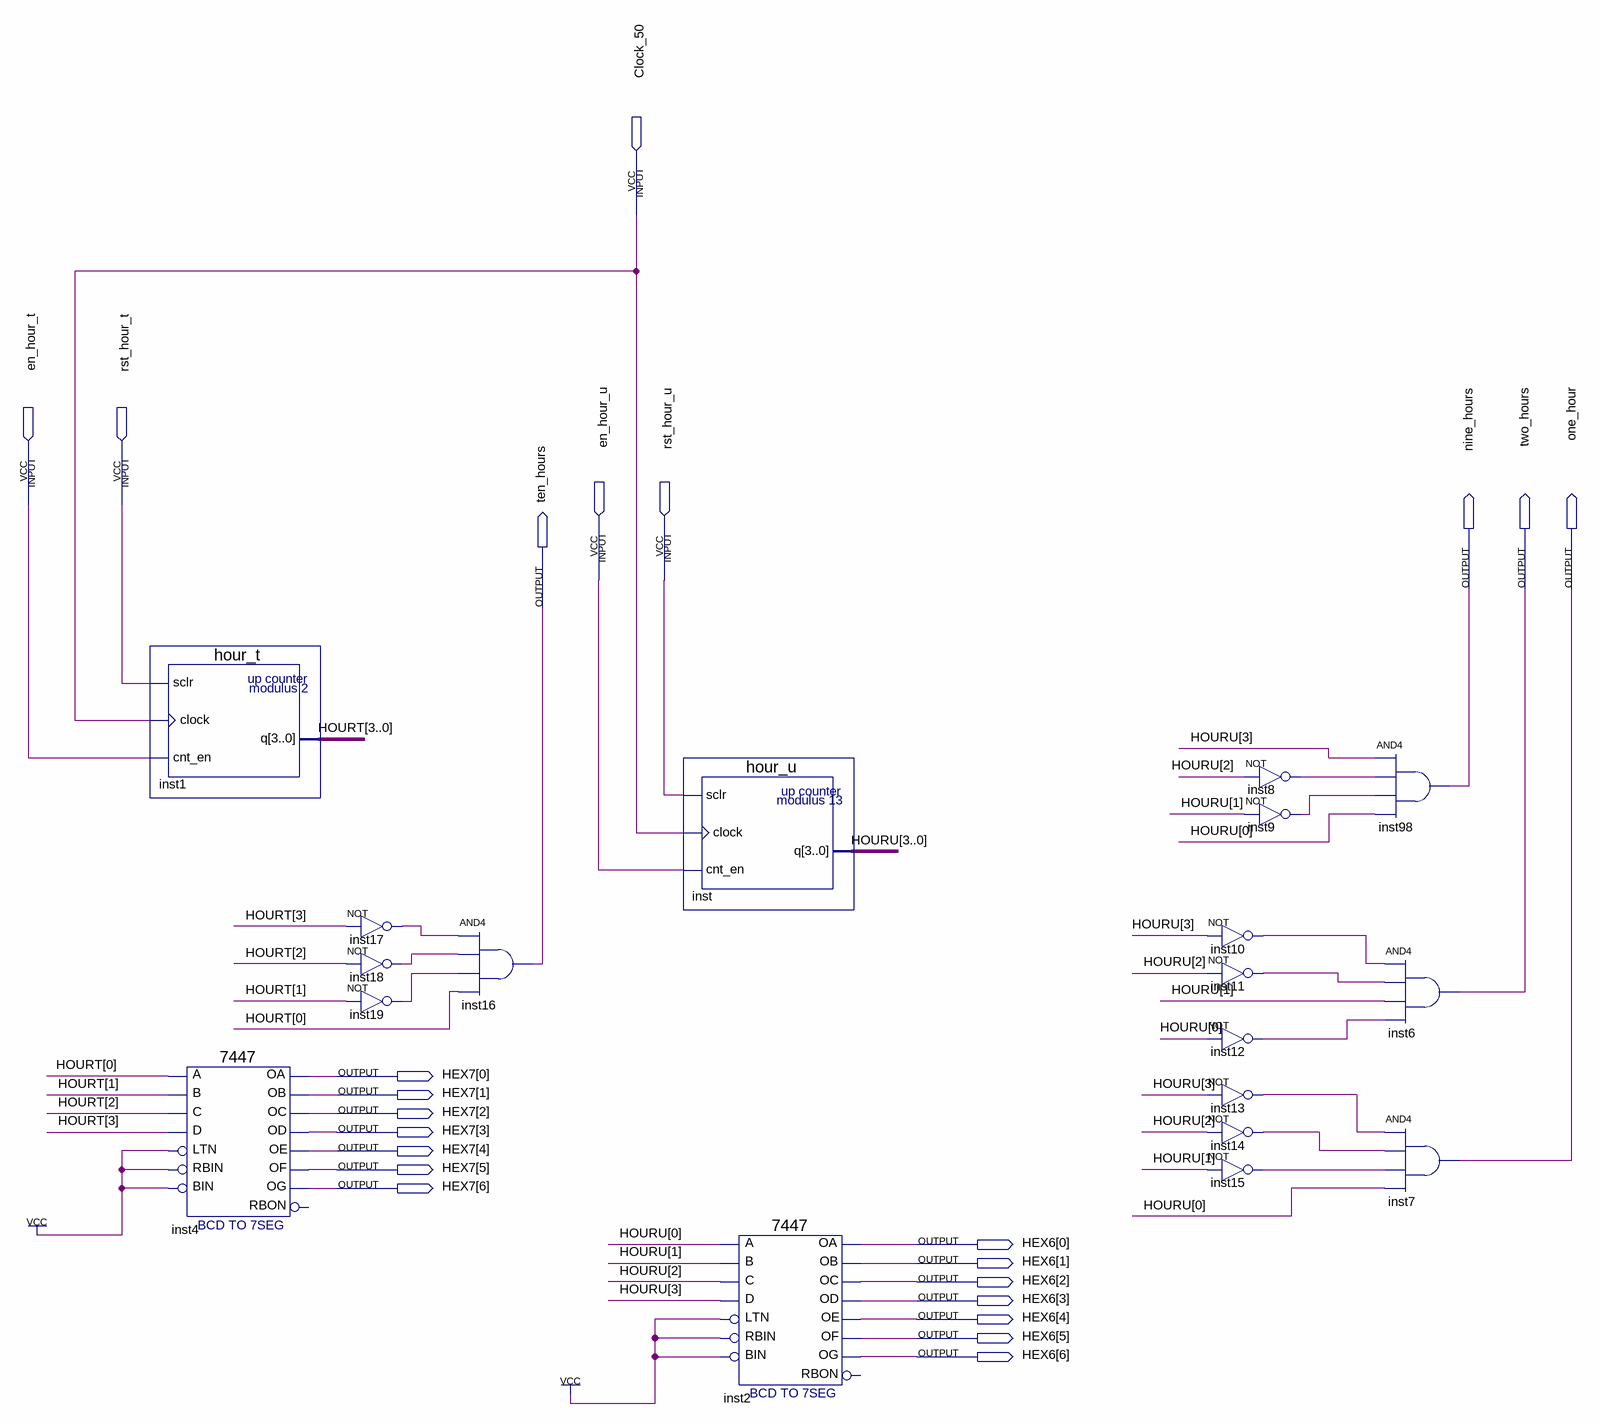
[diagram p0: schematic sheet]
// Quartus schematic Final.bdf as structural Verilog: 19 symbols, 23 pins
module Final (
  input  Clock_50,
  input  en_hour_t,
  input  rst_hour_t,
  input  en_hour_u,
  input  rst_hour_u,
  output nine_hours,
  output two_hours,
  output one_hour,
  output ten_hours,
  output [6:0] HEX7,
  output [6:0] HEX6
);

  wire inst8_out, inst9_out, inst10_out, inst11_out, inst12_out, inst13_out, inst14_out, inst15_out,
       inst17_out, inst18_out, inst19_out;
  wire [3:0] HOURT, HOURU;

  hour_t inst1 (.sclr(rst_hour_t), .clock(Clock_50), .cnt_en(en_hour_t), .q(HOURT));
  \7447  inst4 (
    .LTN(1'b1), .B(HOURT[1]), .C(HOURT[2]), .D(HOURT[3]), .RBIN(1'b1), .BIN(1'b1), .A(HOURT[0]),
    .OB(HEX7[1]), .OC(HEX7[2]), .OE(HEX7[4]), .OD(HEX7[3]), .OF(HEX7[5]), .OG(HEX7[6]), .OA(HEX7[0]));  // open: RBON
  not inst17 (inst17_out, HOURT[3]);
  not inst18 (inst18_out, HOURT[2]);
  not inst19 (inst19_out, HOURT[1]);
  and inst16 (ten_hours, inst17_out, inst18_out, inst19_out, HOURT[0]);
  hour_u inst (.sclr(rst_hour_u), .clock(Clock_50), .cnt_en(en_hour_u), .q(HOURU));
  \7447  inst2 (
    .LTN(1'b1), .B(HOURU[1]), .C(HOURU[2]), .D(HOURU[3]), .RBIN(1'b1), .BIN(1'b1), .A(HOURU[0]),
    .OB(HEX6[1]), .OC(HEX6[2]), .OE(HEX6[4]), .OD(HEX6[3]), .OF(HEX6[5]), .OG(HEX6[6]), .OA(HEX6[0]));  // open: RBON
  not inst10 (inst10_out, HOURU[3]);
  not inst11 (inst11_out, HOURU[2]);
  not inst12 (inst12_out, HOURU[0]);
  not inst13 (inst13_out, HOURU[3]);
  not inst14 (inst14_out, HOURU[2]);
  not inst15 (inst15_out, HOURU[1]);
  not inst8 (inst8_out, HOURU[2]);
  not inst9 (inst9_out, HOURU[1]);
  and inst98 (nine_hours, HOURU[3], inst8_out, inst9_out, HOURU[0]);
  and inst6 (two_hours, inst10_out, inst11_out, HOURU[1], inst12_out);
  and inst7 (one_hour, inst13_out, inst14_out, inst15_out, HOURU[0]);
endmodule
